# EAGLE schematic gamekeys (EAGLE 6.6.0)
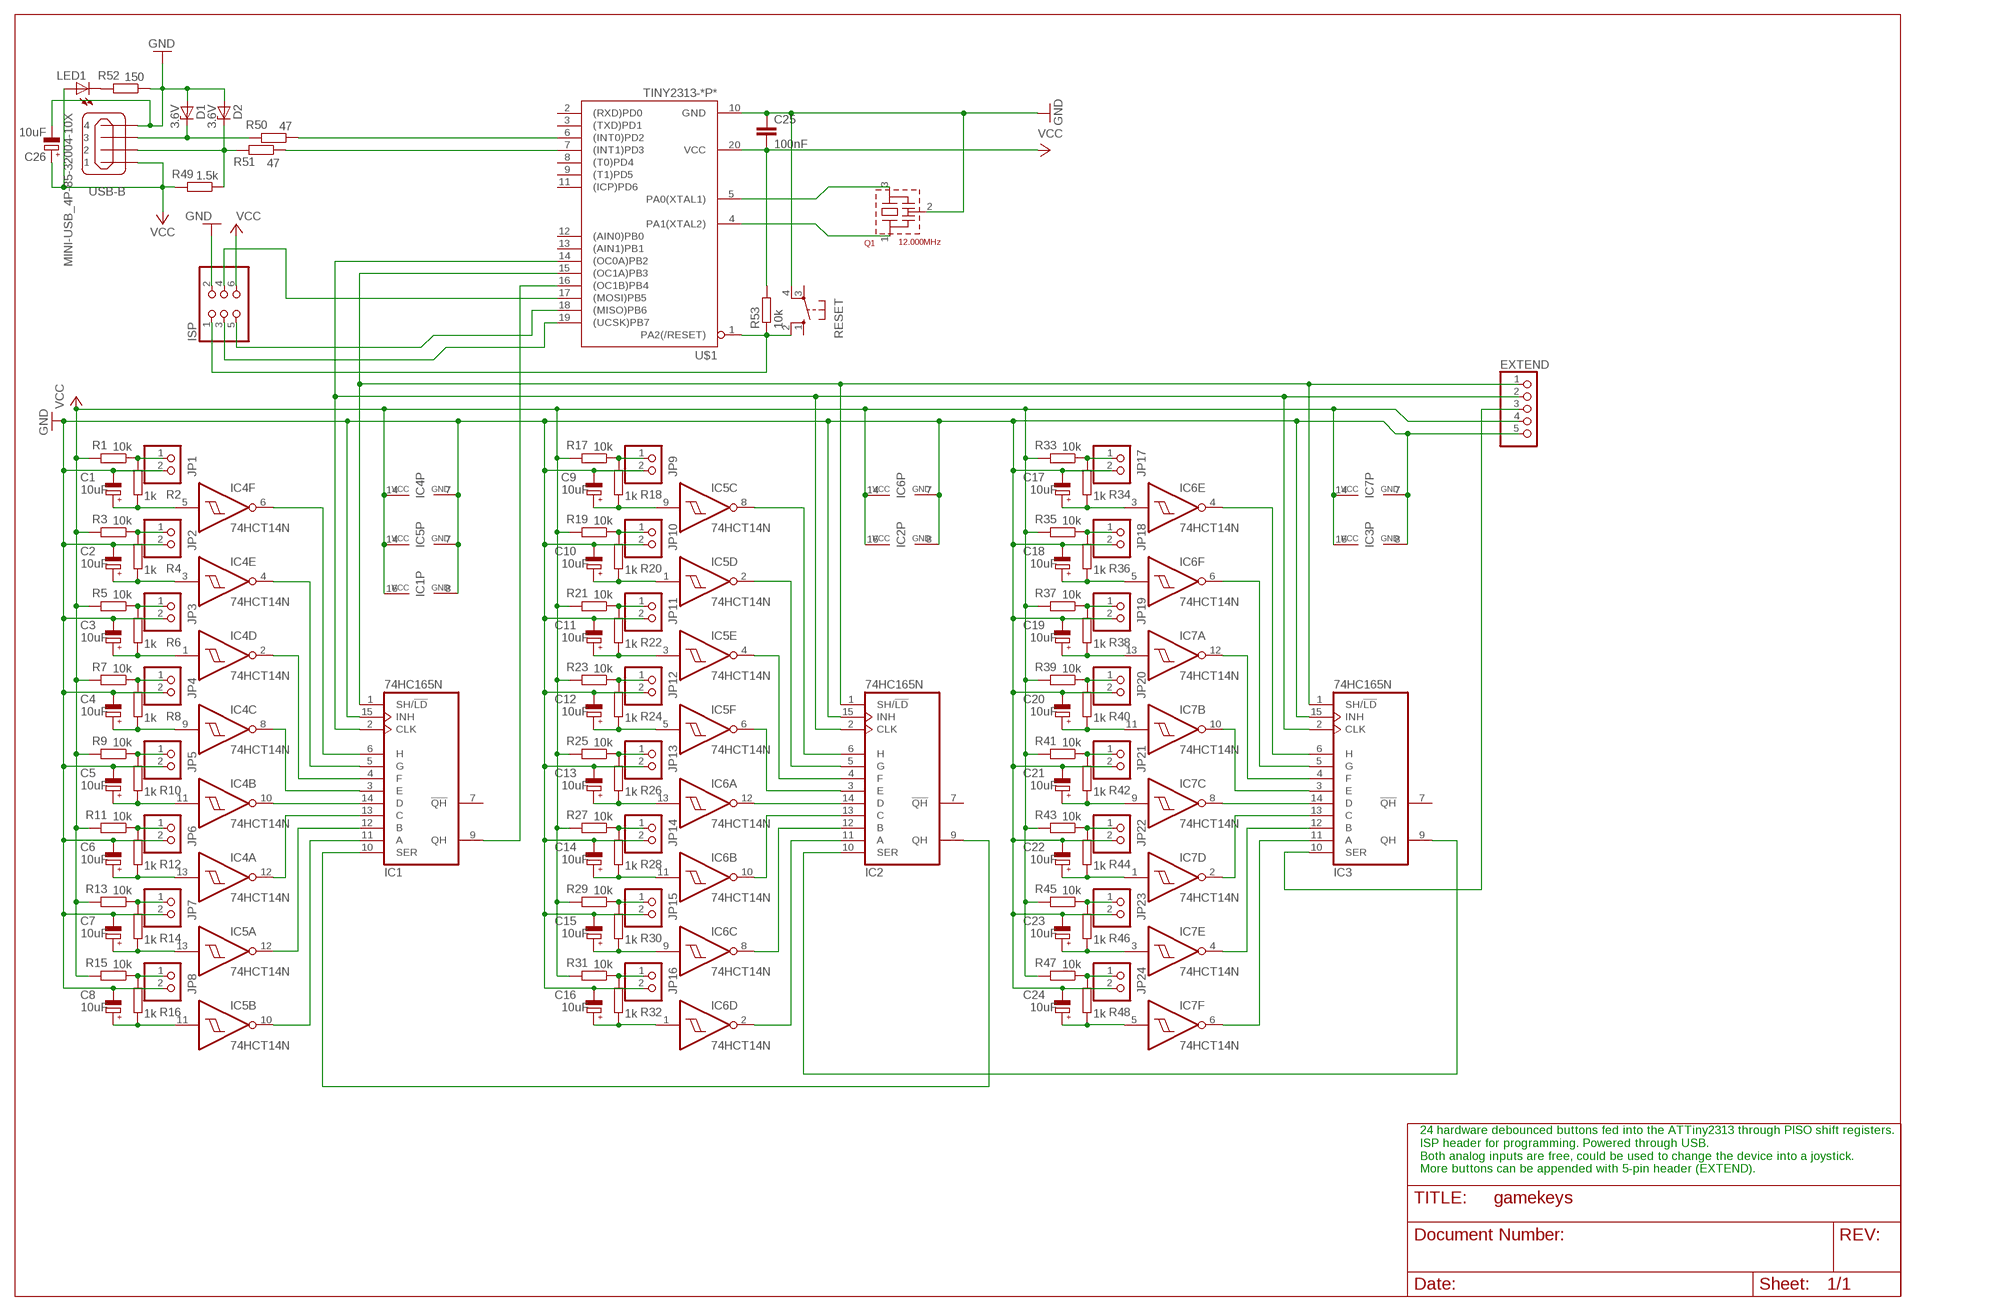
[diagram p0: schematic, sheet 1]

## Parts
C1  10uF  CPOL-EUE1.8-4  [E1,8-4]
C2  10uF  CPOL-EUE1.8-4  [E1,8-4]
C3  10uF  CPOL-EUE1.8-4  [E1,8-4]
C4  10uF  CPOL-EUE1.8-4  [E1,8-4]
C5  10uF  CPOL-EUE1.8-4  [E1,8-4]
C6  10uF  CPOL-EUE1.8-4  [E1,8-4]
C7  10uF  CPOL-EUE1.8-4  [E1,8-4]
C8  10uF  CPOL-EUE1.8-4  [E1,8-4]
C9  10uF  CPOL-EUE1.8-4  [E1,8-4]
C10  10uF  CPOL-EUE1.8-4  [E1,8-4]
C11  10uF  CPOL-EUE1.8-4  [E1,8-4]
C12  10uF  CPOL-EUE1.8-4  [E1,8-4]
C13  10uF  CPOL-EUE1.8-4  [E1,8-4]
C14  10uF  CPOL-EUE1.8-4  [E1,8-4]
C15  10uF  CPOL-EUE1.8-4  [E1,8-4]
C16  10uF  CPOL-EUE1.8-4  [E1,8-4]
C17  10uF  CPOL-EUE1.8-4  [E1,8-4]
C18  10uF  CPOL-EUE1.8-4  [E1,8-4]
C19  10uF  CPOL-EUE1.8-4  [E1,8-4]
C20  10uF  CPOL-EUE1.8-4  [E1,8-4]
C21  10uF  CPOL-EUE1.8-4  [E1,8-4]
C22  10uF  CPOL-EUE1.8-4  [E1,8-4]
C23  10uF  CPOL-EUE1.8-4  [E1,8-4]
C24  10uF  CPOL-EUE1.8-4  [E1,8-4]
C25  100nF  C-EU025-024X044  [C025-024X044]
C26  10uF  CPOL-EUE2-4  [E2-4]
D1  3.6V  ZENER-DIODEDO35Z10  [DO35Z10]
D2  3.6V  ZENER-DIODEDO35Z10  [DO35Z10]
EXTEND  PINHD-1X5  [1X05]
IC1  74HC165N  [DIL16]
IC2  74HC165N  [DIL16]
IC3  74HC165N  [DIL16]
IC4  74HCT14N  [DIL14]
IC5  74HCT14N  [DIL14]
IC6  74HCT14N  [DIL14]
IC7  74HCT14N  [DIL14]
ISP  PINHD-2X3  [2X03]
JP1  PINHD-1X2  [1X02]
JP2  PINHD-1X2  [1X02]
JP3  PINHD-1X2  [1X02]
JP4  PINHD-1X2  [1X02]
JP5  PINHD-1X2  [1X02]
JP6  PINHD-1X2  [1X02]
JP7  PINHD-1X2  [1X02]
JP8  PINHD-1X2  [1X02]
JP9  PINHD-1X2  [1X02]
JP10  PINHD-1X2  [1X02]
JP11  PINHD-1X2  [1X02]
JP12  PINHD-1X2  [1X02]
JP13  PINHD-1X2  [1X02]
JP14  PINHD-1X2  [1X02]
JP15  PINHD-1X2  [1X02]
JP16  PINHD-1X2  [1X02]
JP17  PINHD-1X2  [1X02]
JP18  PINHD-1X2  [1X02]
JP19  PINHD-1X2  [1X02]
JP20  PINHD-1X2  [1X02]
JP21  PINHD-1X2  [1X02]
JP22  PINHD-1X2  [1X02]
JP23  PINHD-1X2  [1X02]
JP24  PINHD-1X2  [1X02]
LED1  LEDLZR181  [LZR181]
Q1  12.000MHz  CSTLS_G  [CSTLS_G8]
R1  10k  R-EU_0204/2V  [0204V]
R2  1k  R-EU_0204/2V  [0204V]
R3  10k  R-EU_0204/2V  [0204V]
R4  1k  R-EU_0204/2V  [0204V]
R5  10k  R-EU_0204/2V  [0204V]
R6  1k  R-EU_0204/2V  [0204V]
R7  10k  R-EU_0204/2V  [0204V]
R8  1k  R-EU_0204/2V  [0204V]
R9  10k  R-EU_0204/2V  [0204V]
R10  1k  R-EU_0204/2V  [0204V]
R11  10k  R-EU_0204/2V  [0204V]
R12  1k  R-EU_0204/2V  [0204V]
R13  10k  R-EU_0204/2V  [0204V]
R14  1k  R-EU_0204/2V  [0204V]
R15  10k  R-EU_0204/2V  [0204V]
R16  1k  R-EU_0204/2V  [0204V]
R17  10k  R-EU_0204/2V  [0204V]
R18  1k  R-EU_0204/2V  [0204V]
R19  10k  R-EU_0204/2V  [0204V]
R20  1k  R-EU_0204/2V  [0204V]
R21  10k  R-EU_0204/2V  [0204V]
R22  1k  R-EU_0204/2V  [0204V]
R23  10k  R-EU_0204/2V  [0204V]
R24  1k  R-EU_0204/2V  [0204V]
R25  10k  R-EU_0204/2V  [0204V]
R26  1k  R-EU_0204/2V  [0204V]
R27  10k  R-EU_0204/2V  [0204V]
R28  1k  R-EU_0204/2V  [0204V]
R29  10k  R-EU_0204/2V  [0204V]
R30  1k  R-EU_0204/2V  [0204V]
R31  10k  R-EU_0204/2V  [0204V]
R32  1k  R-EU_0204/2V  [0204V]
R33  10k  R-EU_0204/2V  [0204V]
R34  1k  R-EU_0204/2V  [0204V]
R35  10k  R-EU_0204/2V  [0204V]
R36  1k  R-EU_0204/2V  [0204V]
R37  10k  R-EU_0204/2V  [0204V]
R38  1k  R-EU_0204/2V  [0204V]
R39  10k  R-EU_0204/2V  [0204V]
R40  1k  R-EU_0204/2V  [0204V]
R41  10k  R-EU_0204/2V  [0204V]
R42  1k  R-EU_0204/2V  [0204V]
R43  10k  R-EU_0204/2V  [0204V]
R44  1k  R-EU_0204/2V  [0204V]
R45  10k  R-EU_0204/2V  [0204V]
R46  1k  R-EU_0204/2V  [0204V]
R47  10k  R-EU_0204/2V  [0204V]
R48  1k  R-EU_0204/2V  [0204V]
R49  1.5k  R-EU_0204/2V  [0204V]
R50  47  R-EU_0204/2V  [0204V]
R51  47  R-EU_0204/2V  [0204V]
R52  150  R-EU_0204/2V  [0204V]
R53  10k  R-EU_0207/7  [0207/7]
RESET  10-XX  [B3F-10XX]
U$1  TINY2313-*P*  [DIL20]
USB-B  MINI-USB_4P-85-32004-10X  [85-32004-10X]

## Nets
GND: C1.- C2.- C3.- C4.- C5.- C6.- C7.- C8.- C9.- C10.- C11.- C12.- C13.- C14.- C15.- C16.- C17.- C18.- C19.- C20.- C21.- C22.- C23.- C24.- C25.1 C26.- D1.A D2.A EXTEND.5 IC1.8(GND) IC1.15(INH) IC2.8(GND) IC2.15(INH) IC3.8(GND) IC3.15(INH) IC4.7(P:GND) IC5.7(P:GND) IC6.7(P:GND) IC7.7(P:GND) ISP.2 JP1.2 JP2.2 JP3.2 JP4.2 JP5.2 JP6.2 JP7.2 JP8.2 JP9.2 JP10.2 JP11.2 JP12.2 JP13.2 JP14.2 JP15.2 JP16.2 JP17.2 JP18.2 JP19.2 JP20.2 JP21.2 JP22.2 JP23.2 JP24.2 Q1.2(VSS) R52.1 RESET.4(P1) U$1.10(GND) USB-B.4
GND2: C16.+ IC6.1(D:I) R32.1
GND4: C24.+ IC7.5(F:I) R48.1
GND6: C8.+ IC5.11(B:I) R16.1
N$1: JP1.1 R1.1 R2.2
N$2: JP2.1 R3.1 R4.2
N$3: C1.+ IC4.5(F:I) R2.1
N$4: JP7.1 R13.1 R14.2
N$5: JP3.1 R5.1 R6.2
N$6: C7.+ IC5.13(A:I) R14.1
N$7: JP4.1 R7.1 R8.2
N$8: JP8.1 R15.1 R16.2
N$9: JP5.1 R9.1 R10.2
N$10: C6.+ IC4.13(A:I) R12.1
N$11: JP6.1 R11.1 R12.2
N$12: C5.+ IC4.11(B:I) R10.1
N$13: C4.+ IC4.9(C:I) R8.1
N$14: C3.+ IC4.1(D:I) R6.1
N$15: C2.+ IC4.3(E:I) R4.1
N$16: IC1.11(A) IC5.10(B:O)
N$17: IC1.12(B) IC5.12(A:O)
N$18: IC1.13(C) IC4.12(A:O)
N$19: IC1.14(D) IC4.10(B:O)
N$20: IC1.3(E) IC4.8(C:O)
N$21: IC1.4(F) IC4.2(D:O)
N$22: IC1.5(G) IC4.4(E:O)
N$23: IC1.6(H) IC4.6(F:O)
N$24: JP9.1 R17.1 R18.2
N$25: C9.+ IC5.9(C:I) R18.1
N$26: JP10.1 R19.1 R20.2
N$27: JP11.1 R21.1 R22.2
N$28: JP12.1 R23.1 R24.2
N$29: JP13.1 R25.1 R26.2
N$30: JP14.1 R27.1 R28.2
N$31: JP15.1 R29.1 R30.2
N$32: C15.+ IC6.9(C:I) R30.1
N$33: JP16.1 R31.1 R32.2
N$34: C14.+ IC6.11(B:I) R28.1
N$35: C13.+ IC6.13(A:I) R26.1
N$36: C12.+ IC5.5(F:I) R24.1
N$37: C11.+ IC5.3(E:I) R22.1
N$38: C10.+ IC5.1(D:I) R20.1
N$39: IC2.11(A) IC6.2(D:O)
N$40: IC2.12(B) IC6.8(C:O)
N$41: IC2.13(C) IC6.10(B:O)
N$42: IC2.14(D) IC6.12(A:O)
N$43: IC2.3(E) IC5.6(F:O)
N$44: IC2.4(F) IC5.4(E:O)
N$45: IC2.5(G) IC5.2(D:O)
N$46: IC2.6(H) IC5.8(C:O)
N$47: JP17.1 R33.1 R34.2
N$48: C17.+ IC6.3(E:I) R34.1
N$49: JP18.1 R35.1 R36.2
N$50: JP19.1 R37.1 R38.2
N$51: JP20.1 R39.1 R40.2
N$52: JP21.1 R41.1 R42.2
N$53: JP22.1 R43.1 R44.2
N$54: JP23.1 R45.1 R46.2
N$55: C23.+ IC7.3(E:I) R46.1
N$56: JP24.1 R47.1 R48.2
N$57: C22.+ IC7.1(D:I) R44.1
N$58: C21.+ IC7.9(C:I) R42.1
N$59: C20.+ IC7.11(B:I) R40.1
N$60: C19.+ IC7.13(A:I) R38.1
N$61: C18.+ IC6.5(F:I) R36.1
N$62: IC3.11(A) IC7.6(F:O)
N$63: IC3.12(B) IC7.4(E:O)
N$64: IC3.13(C) IC7.2(D:O)
N$65: IC3.14(D) IC7.8(C:O)
N$66: IC3.3(E) IC7.10(B:O)
N$67: IC3.4(F) IC7.12(A:O)
N$68: IC3.5(G) IC6.6(F:O)
N$69: IC3.6(H) IC6.4(E:O)
N$70: EXTEND.2 IC1.2(CLK) IC2.2(CLK) IC3.2(CLK) U$1.14((OC0A)PB2)
N$71: EXTEND.1 IC1.1(SH/!LD) IC2.1(SH/!LD) IC3.1(SH/!LD) U$1.15((OC1A)PB3)
N$72: ISP.1 R53.1 RESET.2(S1) U$1.1(PA2(/RESET))
N$73: Q1.3 U$1.5(PA0(XTAL1))
N$74: Q1.1 U$1.4(PA1(XTAL2))
N$75: IC2.10(SER) IC3.9(QH)
N$76: IC1.10(SER) IC2.9(QH)
N$77: IC1.9(QH) U$1.16((OC1B)PB4)
N$78: D1.C R50.2 USB-B.3
N$79: EXTEND.3 IC3.10(SER)
N$80: ISP.4 U$1.17((MOSI)PB5)
N$81: ISP.3 U$1.19((UCSK)PB7)
N$83: D2.C R49.1 R51.2 USB-B.2
N$84: R50.1 U$1.6((INT0)PD2)
N$85: R51.1 U$1.7((INT1)PD3)
N$86: LED1.K(C) R52.2
N$87: ISP.5 U$1.18((MISO)PB6)
VCC: C25.2 C26.+ EXTEND.4 IC1.16(VCC) IC2.16(VCC) IC3.16(VCC) IC4.14(P:VCC) IC5.14(P:VCC) IC6.14(P:VCC) IC7.14(P:VCC) ISP.6 LED1.A R1.2 R3.2 R5.2 R7.2 R9.2 R11.2 R13.2 R15.2 R17.2 R19.2 R21.2 R23.2 R25.2 R27.2 R29.2 R31.2 R33.2 R35.2 R37.2 R39.2 R41.2 R43.2 R45.2 R47.2 R49.2 R53.2 U$1.20(VCC) USB-B.1
Unconnected: IC1.7(!QH) IC2.7(!QH) IC3.7(!QH) RESET.1(S) RESET.3(P) U$1.2((RXD)PD0) U$1.3((TXD)PD1) U$1.8((T0)PD4) U$1.9((T1)PD5) U$1.11((ICP)PD6) U$1.12((AIN0)PB0) U$1.13((AIN1)PB1)

## Notes on the sheet
- 24 hardware debounced buttons fed into the ATTiny2313 through PISO shift registers. 
  ISP header for programming. Powered through USB.
  Both analog inputs are free, could be used to change the device into a joystick.
  More buttons can be appended with 5-pin header (EXTEND).

## Library data of the parts
C1-C24 C26 = rcl:CPOL-EU: POLARIZED CAPACITOR, European symbol
C25 = rcl:C-EU: CAPACITOR, European symbol
D1 D2 = diode:ZENER-DIODE: Z-Diode
EXTEND = pinhead:PINHD-1X5: PIN HEADER
IC1-IC3 = 74xx-eu:74*165: 8-bit parallel load SHIFT REGISTER
IC4-IC7 = 74xx-eu:74*14: Hex schmitt trigger INVERTER
ISP = pinhead:PINHD-2X3: PIN HEADER
JP1-JP24 = pinhead:PINHD-1X2: PIN HEADER
LED1 = led:LED: LED OSRAM: - CHIPLED LG R971, LG N971, LY N971, LG Q971, LY Q971, LO R971, LY R971 LH N974, LH R974 LS Q976, LO Q976, LY Q976 LO Q996 - Hyper CHIPLED LW Q18S LB Q993, LB Q99A, LB R99A - SideLED LS A670, LO A670, LY A670, LG A670, LP A670 LB A673, LV A673, LT A673, LW A673 LH A674 LY A675 LS A676, LA A676, LO A676, LY A676, LW A676 LS A679, LY A679, LG A679 - Hyper Micro SIDELED® LS Y876, LA Y876, LO Y876, LY Y876 LT Y87S - SmartLED LW L88C, LW L88S LB L89C, LB L89S, LG L890 LS L89K, LO L89K, LY L89K LS L896, LA L896, LO L896, LY L896 - TOPLED LS T670, LO T670, LY T670, LG T670, LP T670 LSG T670, LSP T670, LSY T670, LOP T670, LYG T670 LG T671, LOG T671, LSG T671 LB T673, LV T673, LT T673, LW T673 LH T674 LS T676, LA T676, LO T676, LY T676, LB T676, LH T676, LSB T676, LW T676 LB T67C, LV T67C, LT T67C, LS T67K, LO T67K, LY T67K, LW E67C LS E67B, LA E67B, LO E67B, LY E67B, LB E67C, LV E67C, LT E67C LW T67C LS T679, LY T679, LG T679 LS T770, LO T770, LY T770, LG T770, LP T770 LB T773, LV T773, LT T773, LW T773 LH T774 LS E675, LA E675, LY E675, LS T675 LS T776, LA T776, LO T776, LY T776, LB T776 LHGB T686 LT T68C, LB T68C - Hyper Mini TOPLED® LB M676 - Mini TOPLED Santana® LG M470 LS M47K, LO M47K, LY M47K Source: http://www.osram.convergy.de LUXEON: - LUMILED® LXK2-PW12-R00, LXK2-PW12-S00, LXK2-PW14-U00, LXK2-PW14-V00 LXK2-PM12-R00, LXK2-PM12-S00, LXK2-PM14-U00 LXK2-PE12-Q00, LXK2-PE12-R00, LXK2-PE12-S00, LXK2-PE14-T00, LXK2-PE14-U00 LXK2-PB12-K00, LXK2-PB12-L00, LXK2-PB12-M00, LXK2-PB14-N00, LXK2-PB14-P00, LXK2-PB14-Q00 LXK2-PR12-L00, LXK2-PR12-M00, LXK2-PR14-Q00, LXK2-PR14-R00 LXK2-PD12-Q00, LXK2-PD12-R00, LXK2-PD12-S00 LXK2-PH12-R00, LXK2-PH12-S00 LXK2-PL12-P00, LXK2-PL12-Q00, LXK2-PL12-R00 Source: www.luxeon.com KINGBRIGHT: KA-3528ASYC Source: www.kingbright.com
Q1 = murata-resonators:CSTLS_G: Ceramic resonator 2.00 to 10.00 MHz
R1-R53 = rcl:R-EU_: RESISTOR, European symbol
RESET = switch-omron:10-XX: OMRON SWITCH; MPN: B3F-1000; OC_FARNELL: 176432; OC_NEWARK: 36M3542
U$1 = avr-6:TINY2313*: Atmel Tiny2313 2K Flash, 128 bytes EEPROM, 128 bytes RAM
USB-B = con-cypressindustries:MINI-USB_4P-: MINI USB 4 Pol. Source: www.cypressindustries.com; OC_FARNELL: unknown; OC_NEWARK: unknown